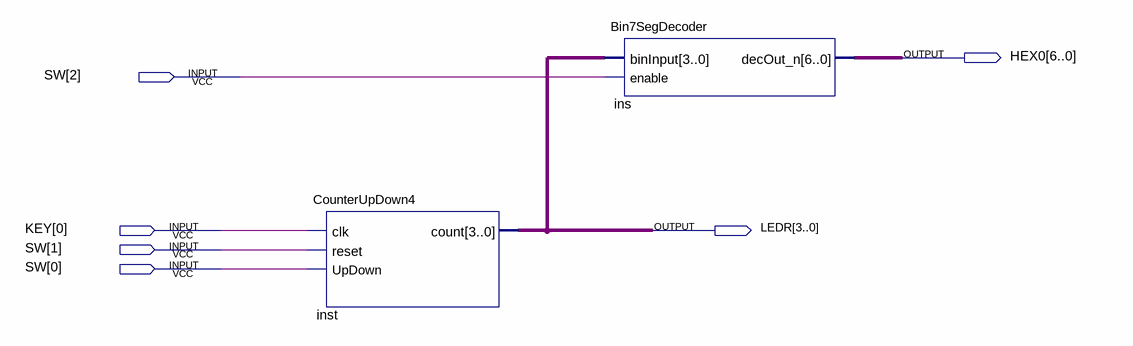
[diagram p0: schematic sheet]
// Quartus schematic Counter_Demo.bdf as structural Verilog: 2 symbols, 6 pins
module Counter_Demo (
  input  [2:0] SW,
  input  [0:0] KEY,
  output [6:0] HEX0,
  output [3:0] LEDR
);

  CounterUpDown4 inst (.clk(KEY[0]), .reset(SW[1]), .UpDown(SW[0]), .count(LEDR));
  Bin7SegDecoder ins (.binInput(LEDR), .enable(SW[2]), .decOut_n(HEX0));
endmodule
